# Altium schematic sheet Servos_controller.SchDoc
size A4; SheetNumber: 2; SheetTotal: 6
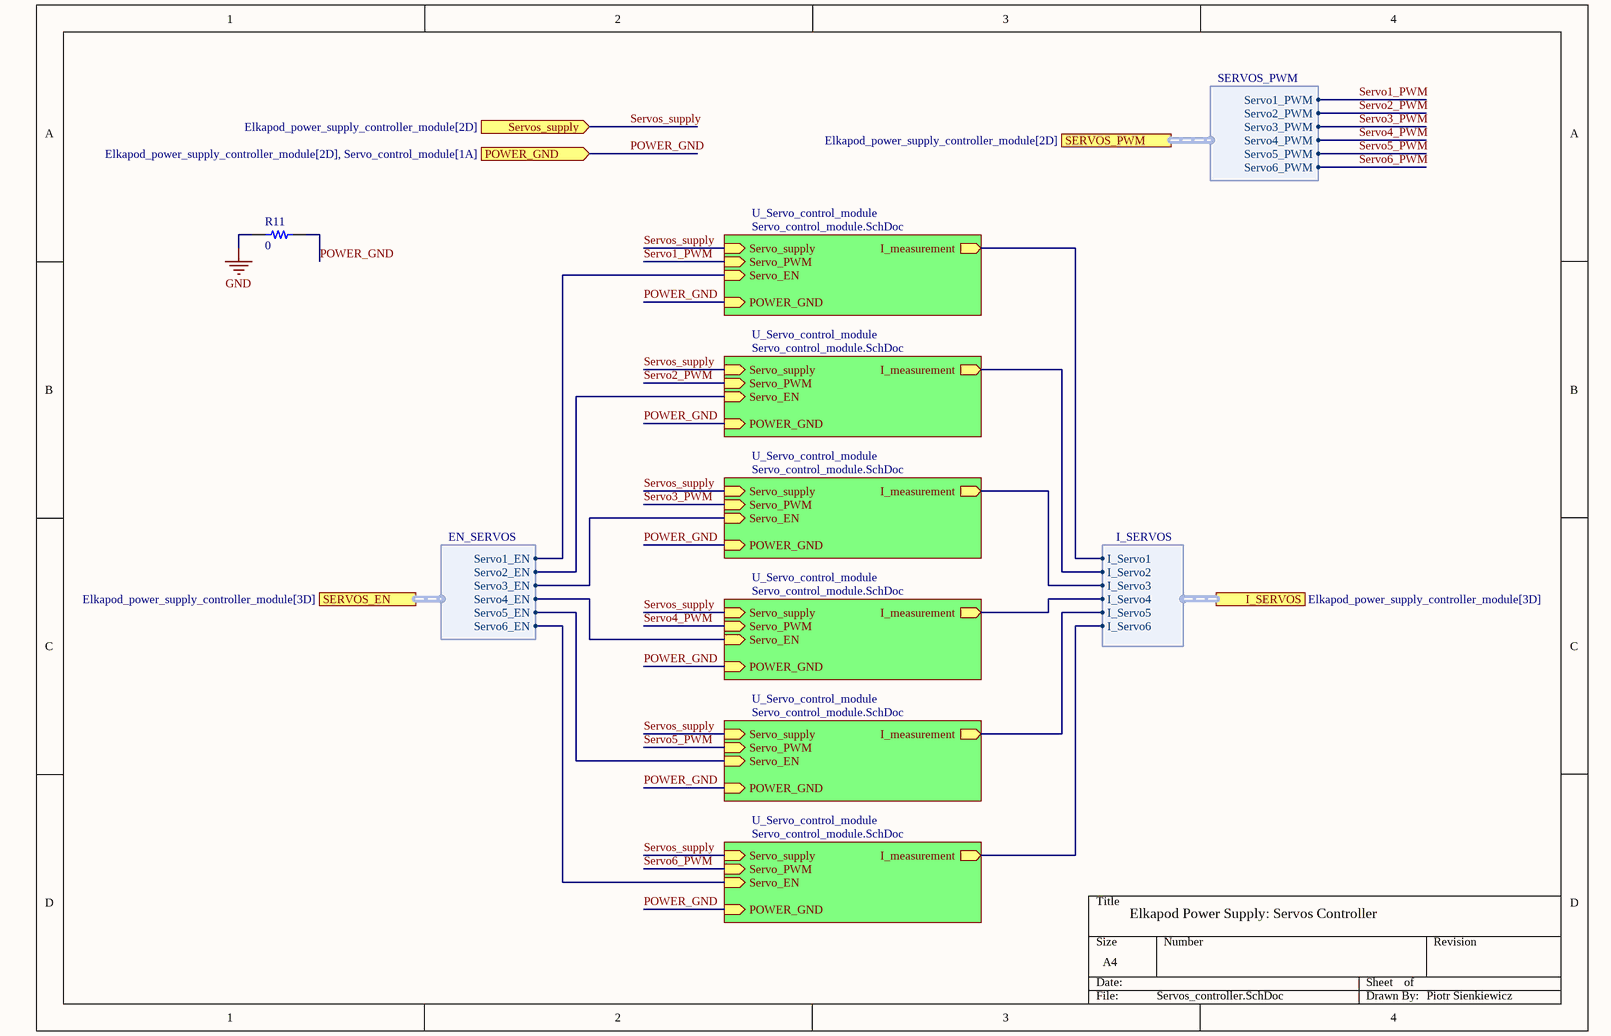
[diagram p0: Servos_controller.SchDoc]

## Parts
R11  0  [RES 0603_1608]

## Sub-sheets
U_Servo_control_module = Servo_control_module.SchDoc: Servo_supply (in), Servo_PWM (in), I_measurement (out), Servo_EN (in), POWER_GND (in)
U_Servo_control_module = Servo_control_module.SchDoc: Servo_supply (in), Servo_PWM (in), I_measurement (out), Servo_EN (in), POWER_GND (in)
U_Servo_control_module = Servo_control_module.SchDoc: Servo_supply (in), Servo_PWM (in), I_measurement (out), Servo_EN (in), POWER_GND (in)
U_Servo_control_module = Servo_control_module.SchDoc: Servo_supply (in), Servo_PWM (in), I_measurement (out), Servo_EN (in), POWER_GND (in)
U_Servo_control_module = Servo_control_module.SchDoc: Servo_supply (in), Servo_PWM (in), I_measurement (out), Servo_EN (in), POWER_GND (in)
U_Servo_control_module = Servo_control_module.SchDoc: Servo_supply (in), Servo_PWM (in), I_measurement (out), Servo_EN (in), POWER_GND (in)

## Ports
I_SERVOS (harness I_SERVOS, see Elkapod_power_supply_controller_module[3D]), POWER_GND (in, see Elkapod_power_supply_controller_module[2D], Servo_control_module[1A]), SERVOS_EN (harness EN_SERVOS, see Elkapod_power_supply_controller_module[3D]), SERVOS_PWM (harness SERVOS_PWM, see Elkapod_power_supply_controller_module[2D]), Servos_supply (in, see Elkapod_power_supply_controller_module[2D])

## Harnesses
I_SERVOS: I_Servo1, I_Servo2, I_Servo3, I_Servo4, I_Servo5, I_Servo6
EN_SERVOS: Servo1_EN, Servo2_EN, Servo3_EN, Servo4_EN, Servo5_EN, Servo6_EN
SERVOS_PWM: Servo1_PWM, Servo2_PWM, Servo3_PWM, Servo4_PWM, Servo5_PWM, Servo6_PWM

## Nets
GND: R11.1
POWER_GND: R11.2 ; port POWER_GND, sheet U_Servo_control_module/POWER_GND, sheet U_Servo_control_module/POWER_GND, sheet U_Servo_control_module/POWER_GND, sheet U_Servo_control_module/POWER_GND, sheet U_Servo_control_module/POWER_GND, sheet U_Servo_control_module/POWER_GND
Servo1_PWM: sheet U_Servo_control_module/Servo_PWM, port SERVOS_PWM.Servo1_PWM
Servo2_PWM: sheet U_Servo_control_module/Servo_PWM, port SERVOS_PWM.Servo2_PWM
Servo3_PWM: sheet U_Servo_control_module/Servo_PWM, port SERVOS_PWM.Servo3_PWM
Servo4_PWM: sheet U_Servo_control_module/Servo_PWM, port SERVOS_PWM.Servo4_PWM
Servo5_PWM: sheet U_Servo_control_module/Servo_PWM, port SERVOS_PWM.Servo5_PWM
Servo6_PWM: sheet U_Servo_control_module/Servo_PWM, port SERVOS_PWM.Servo6_PWM
Servos_supply: port Servos_supply, sheet U_Servo_control_module/Servo_supply, sheet U_Servo_control_module/Servo_supply, sheet U_Servo_control_module/Servo_supply, sheet U_Servo_control_module/Servo_supply, sheet U_Servo_control_module/Servo_supply, sheet U_Servo_control_module/Servo_supply
(unnamed): sheet U_Servo_control_module/I_measurement, port I_SERVOS.I_Servo1
(unnamed): sheet U_Servo_control_module/Servo_EN, port SERVOS_EN.Servo1_EN
(unnamed): sheet U_Servo_control_module/I_measurement, port I_SERVOS.I_Servo2
(unnamed): sheet U_Servo_control_module/Servo_EN, port SERVOS_EN.Servo2_EN
(unnamed): sheet U_Servo_control_module/I_measurement, port I_SERVOS.I_Servo3
(unnamed): sheet U_Servo_control_module/Servo_EN, port SERVOS_EN.Servo3_EN
(unnamed): sheet U_Servo_control_module/I_measurement, port I_SERVOS.I_Servo4
(unnamed): sheet U_Servo_control_module/Servo_EN, port SERVOS_EN.Servo4_EN
(unnamed): sheet U_Servo_control_module/I_measurement, port I_SERVOS.I_Servo5
(unnamed): sheet U_Servo_control_module/Servo_EN, port SERVOS_EN.Servo5_EN
(unnamed): sheet U_Servo_control_module/I_measurement, port I_SERVOS.I_Servo6
(unnamed): sheet U_Servo_control_module/Servo_EN, port SERVOS_EN.Servo6_EN

## Notes on the sheet
- Elkapod Power Supply: Servos Controller
- Piotr Sienkiewicz

## Library data of the parts
R11 = RNCS0603BKE10K0: RES 0 OHM 1% 0,1W 0603; Manufacturer: Stackpole Electronics Inc; Power (Watts): 0.063W, 1/16W; Temperature Coefficient: ±25ppm/°C; Tolerance: ±0.1%; Part Number: RNCS0603BKE10K0; Value: 0; Composition: Thin Film; Device Package: 0603 (1608 Metric); Features: Anti-Corrosive, Automotive AEC-Q200, Moisture Resistant; Height - Seated (Max): 0.022" (0.55mm); LastUpdated: 09.02.2024 20:43:37; Lifecycle Status: Active; Minimum Order: 1; Number of Terminations: 2; Operating Temperature: -55°C ~ 155°C; Package / Case: 0603 (1608 Metric); Packaging: TapeAndReel; PartId: 4838; Part Status: Active; Price: 0.06; Ratings: AEC-Q200; Resistance: 0; Series: RNCS; Size / Dimension: 0.061" L x 0.031" W (1.55mm x 0.80mm); Supplier Device Package: 0603